# Altium project signal-generator.PrjPcb
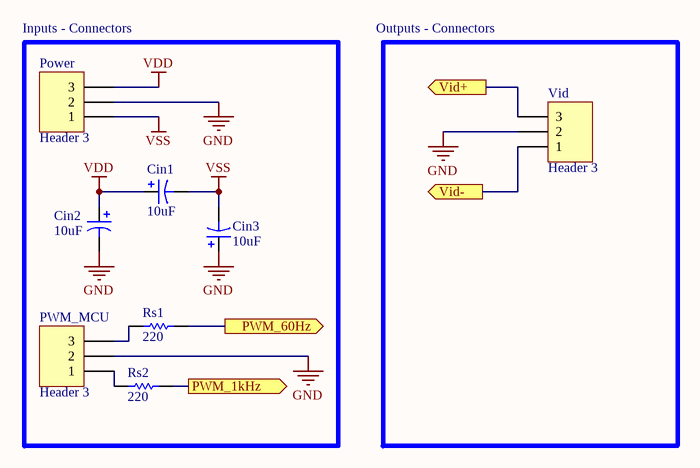
[diagram p0: Generator_main.SchDoc]
4 sheets, 46 parts. Net scope: flat (ports and power ports of the same name join across sheets).
Board file: Signal_Generator.PcbDoc
Sheets:
  Generator_main.SchDoc
  Filters_PWM60Hz.SchDoc
  Filters_PWM1kHz.SchDoc
  Differential_Signal_Generator.SchDoc

## Sheet Generator_main.SchDoc: Differential Signal Generator - Connectors
size A4; Author: Philippe Groulx-Létourneau; DrawnBy: Philippe Groulx-Létourneau; SheetNumber: 1; SheetTotal: 4

### Parts
Cin1  value 10uF  [RB7.6-15]  (hidden comment: Cap Pol1)
Cin2  value 10uF  [RB7.6-15]  (hidden comment: Cap Pol1)
Cin3  value 10uF  [RB7.6-15]  (hidden comment: Cap Pol1)
Power  Header 3  [MTA_3M]
PWM_MCU  Header 3  [MTA_3M]
Rs1  value 220  [Resistor_Axial 0.4]  (hidden comment: Res1)
Rs2  value 220  [Resistor_Axial 0.4]  (hidden comment: Res1)
Vid  Header 3  [MTA_3M]

### Blocks framed on the sheet
Inputs - Connectors: Cin1-Cin3 Power PWM_MCU Rs1 Rs2

### Ports
PWM_1kHz (out, see Filters_PWM1kHz[1B]), PWM_60Hz (out, see Filters_PWM60Hz[1C]), Vid+ (out, see Differential_Signal_Generator[3A]), Vid- (out, see Differential_Signal_Generator[3B])

### Nets
GND: Cin2.2 Cin3.1 Power.2 PWM_MCU.2 Vid.2
VDD: Cin1.1 Cin2.1 Power.3
VSS: Cin1.2 Cin3.2 Power.1
NetPWM_MCU_1: PWM_MCU.1 Rs2.1
NetPWM_MCU_3: PWM_MCU.3 Rs1.1
NetR1_1: Rs1.2 ; port PWM_60Hz
NetR3_1: Rs2.2 ; port PWM_1kHz
NetR8_2: Vid.3 ; port Vid+
NetR13_2: Vid.1 ; port Vid-

### Notes on the sheet
- Outputs - Connectors

### Library data of the parts
Cin1-Cin3 = Cap Pol1: Polarized Capacitor (Radial); Published: 8-Jun-2000; LatestRevisionDate: 17-Jul-2002; LatestRevisionNote: Re-released for DXP Platform.; PackageReference: RB7.6-15; Publisher: Altium Limited; PackageDescription: Polarized Capacitor (Radial); 2 Leads
Power PWM_MCU Vid = Header 3: Header, 3-Pin; LatestRevisionDate: 17-Jul-2002; LatestRevisionNote: Re-released for DXP Platform.; Publisher: Altium Limited
Rs1 Rs2 = Res1: Resistor; Published: 8-Jun-2000; LatestRevisionDate: 17-Jul-2002; LatestRevisionNote: Re-released for DXP Platform.; PackageReference: AXIAL-0.3; Publisher: Altium Limited; PackageDescription: Axial Device, Thru-Hole; 2 Leads; 0.3 in Pin Spacing

## Sheet Filters_PWM60Hz.SchDoc: Differential Signal Generator - 60 Hz PWM Filter
size A4; Author: Philippe Groulx-Létourneau; DrawnBy: Philippe Groulx-Létourneau; SheetNumber: 2; SheetTotal: 4; SPICEModelCacheLZUXPCKQ: <root> / <DocumentId>LZUXPCKQ</DocumentId> / </root>
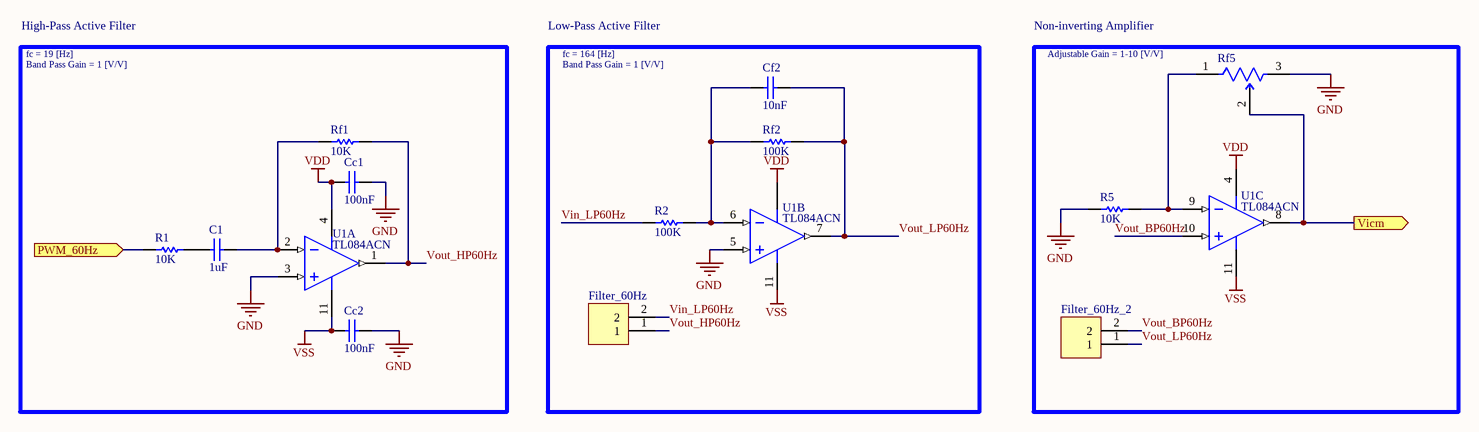
[diagram p1: Filters_PWM60Hz.SchDoc]

### Parts
C1  value 1uF  [condensateur 0.1uf 100mil]  (hidden comment: Cap)
Cc1  value 100nF  [condensateur 0.1uf 100mil]  (hidden comment: Cap)
Cc2  value 100nF  [condensateur 0.1uf 100mil]  (hidden comment: Cap)
Cf2  value 10nF  [condensateur 0.1uf 100mil]  (hidden comment: Cap)
Filter_60Hz  Jumper  [Header 2P 100mil]  (value not drawn)
Filter_60Hz_2  Jumper  [Header 2P 100mil]  (value not drawn)
R1  value 10K  [Resistor_Axial 0.4]  (hidden comment: Res1)
R2  value 100K  [Resistor_Axial 0.4]  (hidden comment: Res1)
R5  value 10K  [Resistor_Axial 0.4]  (hidden comment: Res1)
Rf1  value 10K  [Resistor_Axial 0.4]  (hidden comment: Res1)
Rf2  value 100K  [Resistor_Axial 0.4]  (hidden comment: Res1)
Rf5  67WR100KLF  [FP-67W-MFG]  (value not drawn)
U1  TL084ACN  [N0014A]  (parts A,B,C of 4)

### Blocks framed on the sheet
High-Pass Active Filter: C1 Cc1 Cc2 R1 Rf1 U1
Low-Pass Active Filter: Cf2 Filter_60Hz R2 Rf2 U1
Non-inverting Amplifier: Filter_60Hz_2 R5 Rf5 U1

### Ports
PWM_60Hz (in, see Generator_main[1B]), Vicm (out, see Differential_Signal_Generator[2B])

### Nets
GND: Cc1.2 Cc2.2 R5.1 Rf5.3 U1.3(IN1+) U1.5(IN2+)
VDD: Cc1.1 U1.4(VCC+)
VSS: Cc2.1 U1.11(VCC-)
Vin_LP60Hz: Filter_60Hz.2 R2.1
Vout_BP60Hz: Filter_60Hz_2.2 U1.10(IN3+)
Vout_HP60Hz: Filter_60Hz.1 Rf1.2 U1.1(OUT1)
Vout_LP60Hz: Cf2.2 Filter_60Hz_2.1 Rf2.2 U1.7(OUT2)
NetC1_1: C1.1 R1.2
NetC1_2: C1.2 Rf1.1 U1.2(IN1-)
NetCf2_1: Cf2.1 R2.2 Rf2.1 U1.6(IN2-)
NetR1_1: R1.1 ; port PWM_60Hz
NetR5_2: R5.2 Rf5.1 U1.9(IN3-)
NetR9_1: Rf5.2 U1.8(OUT3) ; port Vicm

### Notes on the sheet
- fc = 19 [Hz]
- Band Pass Gain = 1 [V/V]
- fc = 164 [Hz]
- (near Rf5) Adjustable Gain = 1-10 [V/V]

### Library data of the parts
C1 Cc1 Cc2 Cf2 = Cap: Capacitor; Published: 8-Jun-2000; LatestRevisionDate: 17-Jul-2002; LatestRevisionNote: Re-released for DXP Platform.; PackageReference: RAD-0.3; Publisher: Altium Limited; PackageDescription: Radial Cap, Thru-Hole; 2 Leads; 0.3 in Pin Spacing
Filter_60Hz Filter_60Hz_2 = header 2 pin_UL: CONN HEADER VERT 3POS 2.54MM; LatestRevisionDate: 17-Jul-2002; LatestRevisionNote: Re-released for DXP Platform.; Publisher: Altium Limited; Digikey: 732-5315-ND
R1 R2 R5 Rf1 Rf2 = Res1: Resistor; Published: 8-Jun-2000; LatestRevisionDate: 17-Jul-2002; LatestRevisionNote: Re-released for DXP Platform.; PackageReference: AXIAL-0.3; Publisher: Altium Limited; PackageDescription: Axial Device, Thru-Hole; 2 Leads; 0.3 in Pin Spacing
Rf5 = CMP-50449-000002-1: TRIMMER 100K OHM 0.5W PC PIN TOP; Power Rating: 500mW; Temperature Coefficient: 100ppm/°C; Number of Turns: 20; Voltage Rating: 200V; Resistance: 100kR; Tolerance: 10%; Radiation Hardening: No; Min Operating Temperature: -55°C; Packaging: Bulk; Depth: 4.95mm; Resistor Type: Cermet; Mount: Through Hole; Max Power Dissipation: 500mW; Package Quantity: 100; Length: 9.53mm; REACH SVHC: No SVHC; Voltage Rating (DC): 200V; Series: 67; Height: 0.409inch; Type: Potentiometer; Weight: 1.1g; RoHS Compliant: Yes; Technology: CERMET; Lead Free: Lead Free; Termination: Pin; Resistance Tolerance: 10%; Max Operating Temperature: 125°C; Military Standard: Not
U1 = CMP-0017-00814-2: JFET-Input Operational Amplifier, 7 to 36 V, 0 to 70 degC, 14-pin DIP (N14), Pb-Free (RoHS); Manufacturer: Texas Instruments; Sub Family: General Purpose Amplifier, High Supply Voltage Amplifier (>=30V); Slew Rate(Typ)(V/us): 13; Offset Drift(Typ)(uV/C): 18; GBW(Typ)(MHz): 3; Number of Channels: 4; Rating: Catalog; Total Supply Voltage(Max)(+5V is 5, +/-5V is 10): 36; Vio (25C)(Max)(mV): 6; IIB(Max)(pA): 200; CMRR(Min)(dB): 75; Total Supply Voltage(Min)(+5V is 5, +/-5V is 10): 7; Iq per channel(Max)(mA): 2.8; PackageReference: N0014A; ComponentLink1Description: Manufacturer URL; ComponentLink1URL: http://www.ti.com/; Code_JEDEC: MS-001; PackageVersion: 4040049/E, 12/2002; Mounting Technology: Through Hole; PackageDescription: 14-Pin Plastic In-Line, Body 19.305 x 6.35 mm, Pitch 2.54 mm; ComponentLink2URL: http://www.ti.com/lit/ds/symlink/tl084a.pdf; Vn at 1kHz(Typ)(nV/rtHz): 18; DatasheetVersion: SLOS081G; ComponentLink3Description: Package Specification; ComponentLink3URL: http://www.ti.com/lit/ml/mpdi002c/mpdi002c.pdf; PartNumber: TL084ACN; Eco-Plan: Pb-Free (RoHS); ComponentLink2Description: Datasheet

## Sheet Filters_PWM1kHz.SchDoc: Differential Signal Generator - 1 kHz PWM Filter
size A4; Author: Philippe Groulx-Létourneau; DrawnBy: Philippe Groulx-Létourneau; SheetNumber: 3; SheetTotal: 4; SPICEModelCacheBKCTZZTD: <root> / <DocumentId>BKCTZZTD</DocumentId> / </root>
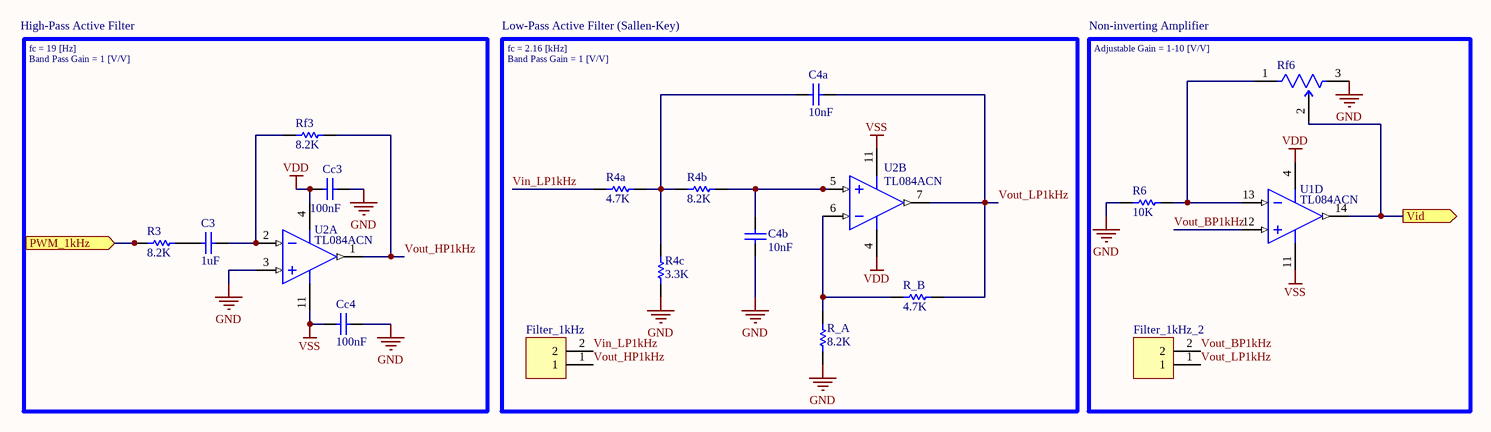
[diagram p2: Filters_PWM1kHz.SchDoc]

### Parts
C3  value 1uF  [condensateur 0.1uf 100mil]  (hidden comment: Cap)
C4a  value 10nF  [condensateur 0.1uf 100mil]  (hidden comment: Cap)
C4b  value 10nF  [condensateur 0.1uf 100mil]  (hidden comment: Cap)
Cc3  value 100nF  [condensateur 0.1uf 100mil]  (hidden comment: Cap)
Cc4  value 100nF  [condensateur 0.1uf 100mil]  (hidden comment: Cap)
Filter_1kHz  Jumper  [Header 2P 100mil]  (value not drawn)
Filter_1kHz_2  Jumper  [Header 2P 100mil]  (value not drawn)
R3  value 8.2K  [Resistor_Axial 0.4]  (hidden comment: Res1)
R4a  value 4.7K  [Resistor_Axial 0.4]  (hidden comment: Res1)
R4b  value 8.2K  [Resistor_Axial 0.4]  (hidden comment: Res1)
R4c  value 3.3K  [Resistor_Axial 0.4]  (hidden comment: Res1)
R6  value 10K  [Resistor_Axial 0.4]  (hidden comment: Res1)
R_A  value 8.2K  [Resistor_Axial 0.4]  (hidden comment: Res1)
R_B  value 4.7K  [Resistor_Axial 0.4]  (hidden comment: Res1)
Rf3  value 8.2K  [Resistor_Axial 0.4]  (hidden comment: Res1)
Rf6  67WR100KLF  [FP-67W-MFG]  (value not drawn)
U1  TL084ACN  [N0014A]  (part D of 4)
U2  TL084ACN  [N0014A]  (parts A,B of 4)

### Blocks framed on the sheet
Low-Pass Active Filter (Sallen-Key): C4a C4b Filter_1kHz R4a R4b R4c R_A R_B U2
Non-inverting Amplifier: Filter_1kHz_2 R6 Rf6 U1

### Ports
PWM_1kHz (in, see Generator_main[1B]), Vid (out, see Differential_Signal_Generator[2B])

### Nets
GND: C4b.1 Cc3.2 Cc4.2 R4c.1 R6.1 R_A.1 Rf6.3 U2.3(IN1+)
VDD: Cc3.1 U1.4(VCC+) U2.4(VCC+)
VSS: Cc4.1 U1.11(VCC-) U2.11(VCC-)
Vin_LP1kHz: Filter_1kHz.2 R4a.1
Vout_BP1kHz: Filter_1kHz_2.2 U1.12(IN4+)
Vout_HP1kHz: Filter_1kHz.1 Rf3.2 U2.1(OUT1)
Vout_LP1kHz: C4a.1 Filter_1kHz_2.1 R_B.2 U2.7(OUT2)
NetC3_1: C3.1 R3.2
NetC3_2: C3.2 Rf3.1 U2.2(IN1-)
NetC4a_2: C4a.2 R4a.2 R4b.1 R4c.2
NetC4b_2: C4b.2 R4b.2 U2.5(IN2+)
NetR3_1: R3.1 ; port PWM_1kHz
NetR6_2: R6.2 Rf6.1 U1.13(IN4-)
NetR10_1: Rf6.2 U1.14(OUT4) ; port Vid
NetR_A_2: R_A.2 R_B.1 U2.6(IN2-)

### Notes on the sheet
- High-Pass Active Filter
- fc = 19 [Hz]
- Band Pass Gain = 1 [V/V]
- fc = 2.16 [kHz]
- Adjustable Gain = 1-10 [V/V]

### Library data of the parts
C3 C4a C4b Cc3 Cc4 = Cap: Capacitor; Published: 8-Jun-2000; LatestRevisionDate: 17-Jul-2002; LatestRevisionNote: Re-released for DXP Platform.; PackageReference: RAD-0.3; Publisher: Altium Limited; PackageDescription: Radial Cap, Thru-Hole; 2 Leads; 0.3 in Pin Spacing
Filter_1kHz Filter_1kHz_2 = header 2 pin_UL: CONN HEADER VERT 3POS 2.54MM; LatestRevisionDate: 17-Jul-2002; LatestRevisionNote: Re-released for DXP Platform.; Publisher: Altium Limited; Digikey: 732-5315-ND
R3 R4a R4b R4c R6 R_A R_B Rf3 = Res1: Resistor; Published: 8-Jun-2000; LatestRevisionDate: 17-Jul-2002; LatestRevisionNote: Re-released for DXP Platform.; PackageReference: AXIAL-0.3; Publisher: Altium Limited; PackageDescription: Axial Device, Thru-Hole; 2 Leads; 0.3 in Pin Spacing
Rf6 = CMP-50449-000002-1: as Rf5 on sheet Filters_PWM60Hz; Radiation Hardening: No; Min Operating Temperature: -55°C; Packaging: Bulk; Depth: 4.95mm; Resistor Type: Cermet; Mount: Through Hole; Max Power Dissipation: 500mW; Package Quantity: 100; Length: 9.53mm; REACH SVHC: No SVHC; Voltage Rating (DC): 200V; Series: 67; Height: 0.409inch; Type: Potentiometer; Weight: 1.1g; RoHS Compliant: Yes; Technology: CERMET; Lead Free: Lead Free; Termination: Pin; Resistance Tolerance: 10%; Max Operating Temperature: 125°C; Military Standard: Not
U1 U2 = CMP-0017-00814-2: as U1 on sheet Filters_PWM60Hz; PackageReference: N0014A; ComponentLink1Description: Manufacturer URL; ComponentLink1URL: http://www.ti.com/; Code_JEDEC: MS-001; PackageVersion: 4040049/E, 12/2002; Mounting Technology: Through Hole; PackageDescription: 14-Pin Plastic In-Line, Body 19.305 x 6.35 mm, Pitch 2.54 mm; ComponentLink2URL: http://www.ti.com/lit/ds/symlink/tl084a.pdf; Vn at 1kHz(Typ)(nV/rtHz): 18; DatasheetVersion: SLOS081G; ComponentLink3Description: Package Specification; ComponentLink3URL: http://www.ti.com/lit/ml/mpdi002c/mpdi002c.pdf; PartNumber: TL084ACN; Eco-Plan: Pb-Free (RoHS); ComponentLink2Description: Datasheet

## Sheet Differential_Signal_Generator.SchDoc: Differentiel Signal Generator - Differential Generator
size A4; Author: Philippe Groulx-Létourneau; DrawnBy: Philippe Groulx-Létourneau; SheetNumber: 4; SheetTotal: 4; SPICEModelCacheOMMOXGID: <root> / <DocumentId>OMMOXGID</DocumentId> / </root>
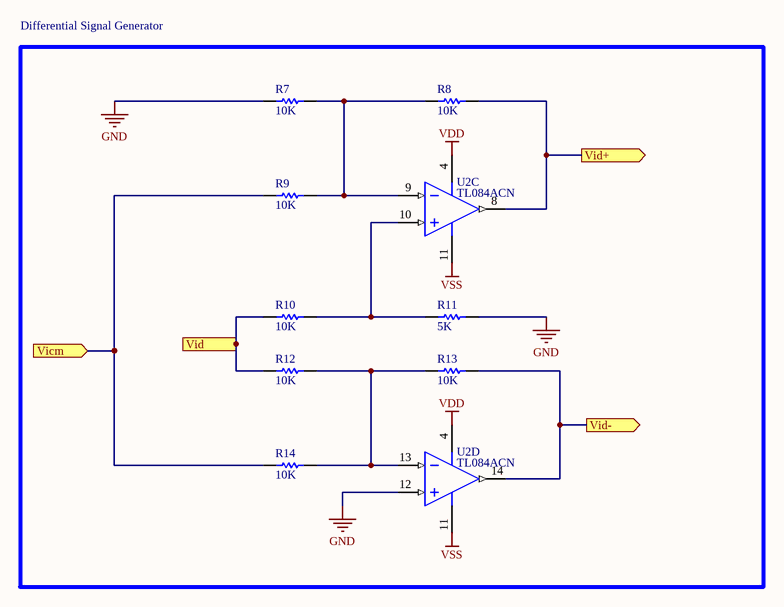
[diagram p3: Differential_Signal_Generator.SchDoc]

### Parts
R7  value 10K  [Resistor_Axial 0.4]  (hidden comment: Res1)
R8  value 10K  [Resistor_Axial 0.4]  (hidden comment: Res1)
R9  value 10K  [Resistor_Axial 0.4]  (hidden comment: Res1)
R10  value 10K  [Resistor_Axial 0.4]  (hidden comment: Res1)
R11  value 5K  [Resistor_Axial 0.4]  (hidden comment: Res1)
R12  value 10K  [Resistor_Axial 0.4]  (hidden comment: Res1)
R13  value 10K  [Resistor_Axial 0.4]  (hidden comment: Res1)
R14  value 10K  [Resistor_Axial 0.4]  (hidden comment: Res1)
U2  TL084ACN  [N0014A]  (parts C,D of 4)

### Blocks framed on the sheet
Differential Signal Generator: R7-R14 U2

### Ports
Vicm (in, see Filters_PWM60Hz[4C]), Vid (in, see Filters_PWM1kHz[4B]), Vid+ (out, see Generator_main[2A]), Vid- (out, see Generator_main[2B])

### Nets
GND: R7.1 R11.2 U2.12(IN4+)
VDD: U2.4(VCC+)
VSS: U2.11(VCC-)
NetR7_2: R7.2 R8.1 R9.2 U2.9(IN3-)
NetR8_2: R8.2 U2.8(OUT3) ; port Vid+
NetR9_1: R9.1 R14.1 ; port Vicm
NetR10_1: R10.1 R12.1 ; port Vid
NetR10_2: R10.2 R11.1 U2.10(IN3+)
NetR12_2: R12.2 R13.1 R14.2 U2.13(IN4-)
NetR13_2: R13.2 U2.14(OUT4) ; port Vid-

### Library data of the parts
R7-R14 = Res1: Resistor; Published: 8-Jun-2000; LatestRevisionDate: 17-Jul-2002; LatestRevisionNote: Re-released for DXP Platform.; PackageReference: AXIAL-0.3; Publisher: Altium Limited; PackageDescription: Axial Device, Thru-Hole; 2 Leads; 0.3 in Pin Spacing
U2 = CMP-0017-00814-2: as U1 on sheet Filters_PWM60Hz; PackageReference: N0014A; ComponentLink1Description: Manufacturer URL; ComponentLink1URL: http://www.ti.com/; Code_JEDEC: MS-001; PackageVersion: 4040049/E, 12/2002; Mounting Technology: Through Hole; PackageDescription: 14-Pin Plastic In-Line, Body 19.305 x 6.35 mm, Pitch 2.54 mm; ComponentLink2URL: http://www.ti.com/lit/ds/symlink/tl084a.pdf; Vn at 1kHz(Typ)(nV/rtHz): 18; DatasheetVersion: SLOS081G; ComponentLink3Description: Package Specification; ComponentLink3URL: http://www.ti.com/lit/ml/mpdi002c/mpdi002c.pdf; PartNumber: TL084ACN; Eco-Plan: Pb-Free (RoHS); ComponentLink2Description: Datasheet

## Nets that join several sheets
GND: Generator_main (5 pins), Filters_PWM60Hz (6 pins), Filters_PWM1kHz (8 pins), Differential_Signal_Generator (R7.1 R11.2 U2.12)
VDD: Generator_main (Cin1.1 Cin2.1 Power.3), Filters_PWM60Hz (Cc1.1 U1.4), Filters_PWM1kHz (Cc3.1 U1.4 U2.4), Differential_Signal_Generator (U2.4)
VSS: Generator_main (Cin1.2 Cin3.2 Power.1), Filters_PWM60Hz (Cc2.1 U1.11), Filters_PWM1kHz (Cc4.1 U1.11 U2.11), Differential_Signal_Generator (U2.11)
NetR1_1: Generator_main (Rs1.2), Filters_PWM60Hz (R1.1)
NetR3_1: Generator_main (Rs2.2), Filters_PWM1kHz (R3.1)
NetR8_2: Generator_main (Vid.3), Differential_Signal_Generator (R8.2 U2.8)
NetR9_1: Filters_PWM60Hz (Rf5.2 U1.8), Differential_Signal_Generator (R9.1 R14.1)
NetR10_1: Filters_PWM1kHz (Rf6.2 U1.14), Differential_Signal_Generator (R10.1 R12.1)
NetR13_2: Generator_main (Vid.1), Differential_Signal_Generator (R13.2 U2.14)